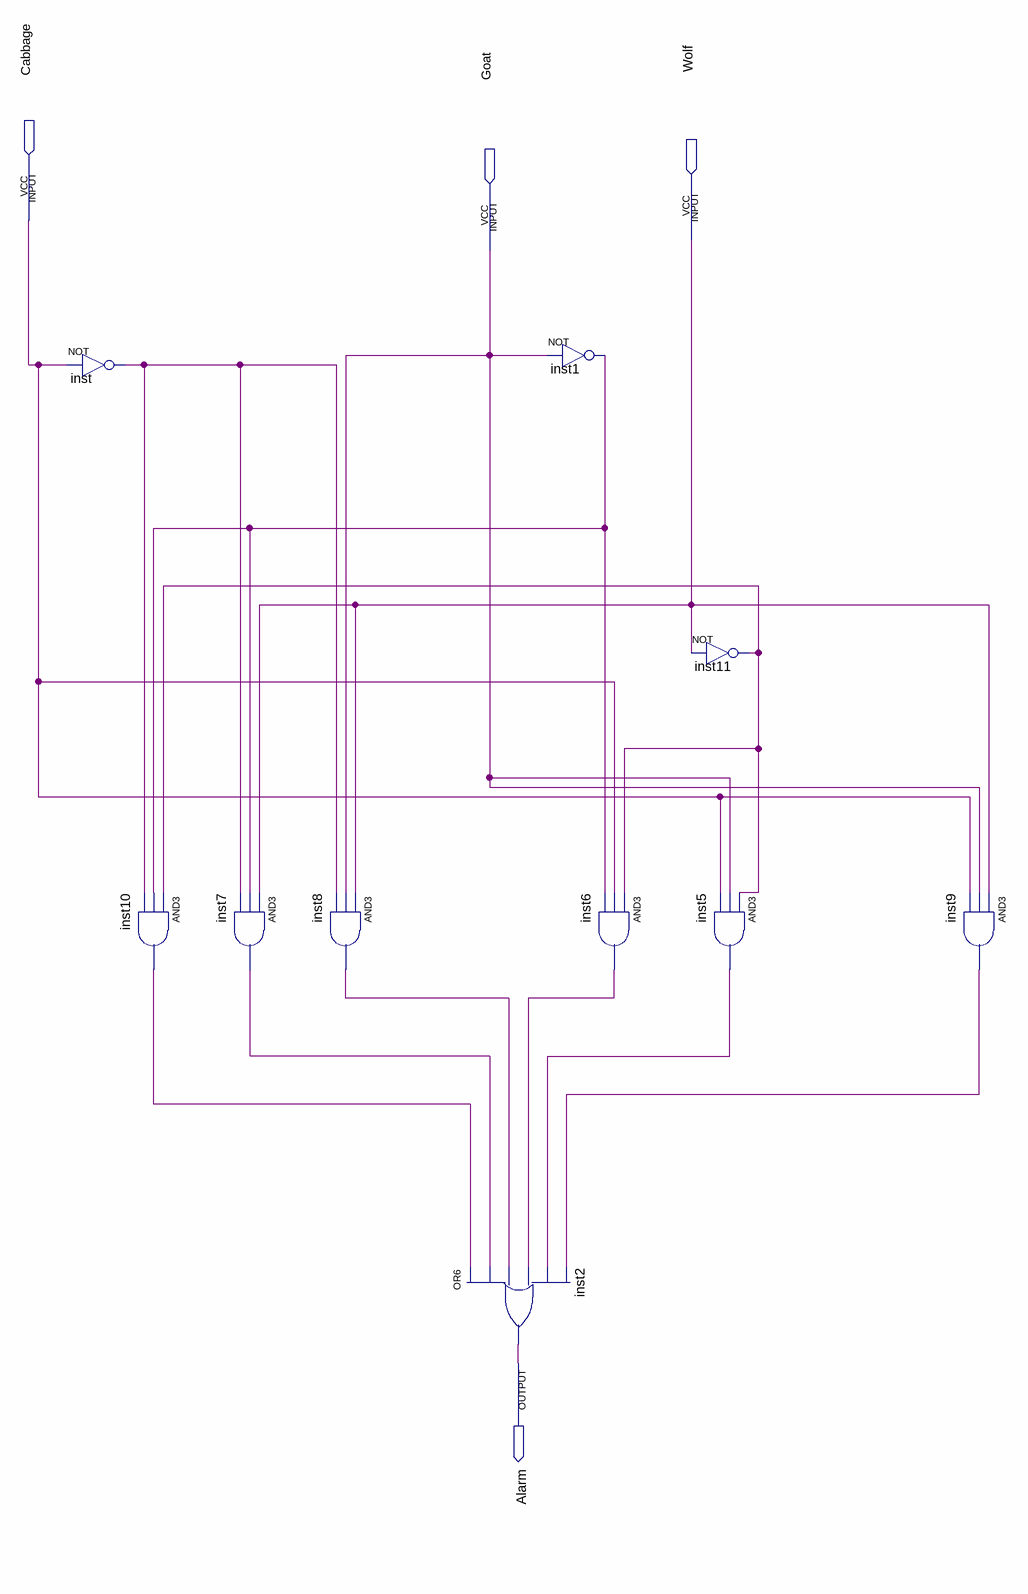
[diagram p0: schematic sheet]
// Quartus schematic lab2step2.bdf as structural Verilog: 10 symbols, 4 pins
module lab2step2 (
  input  Cabbage,
  input  Wolf,
  input  Goat,
  output Alarm
);

  wire inst1_out, inst5_out, inst6_out, inst7_out, inst8_out, inst9_out, inst10_out, inst11_out, inst_out;

  not inst (inst_out, Cabbage);
  and inst10 (inst10_out, inst11_out, inst1_out, inst_out);
  and inst7 (inst7_out, Wolf, inst1_out, inst_out);
  and inst8 (inst8_out, Wolf, Goat, inst_out);
  or inst2 (Alarm, inst10_out, inst7_out, inst8_out, inst6_out, inst5_out, inst9_out);
  not inst1 (inst1_out, Goat);
  and inst6 (inst6_out, inst11_out, Cabbage, inst1_out);
  not inst11 (inst11_out, Wolf);
  and inst5 (inst5_out, inst11_out, Goat, Cabbage);
  and inst9 (inst9_out, Wolf, Goat, Cabbage);
endmodule
